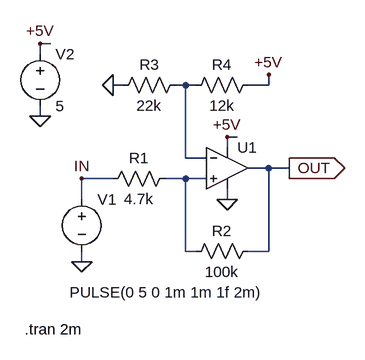
[diagram p0: schematic hys_comparetor.asc]
hys_comparetor.asc, the LTspice schematic file:
Version 4
SHEET 1 880 680
WIRE -64 -16 -80 -16
WIRE -80 0 -80 -16
WIRE 48 48 32 48
WIRE 144 48 128 48
WIRE 160 48 144 48
WIRE 272 48 272 32
WIRE 272 48 240 48
WIRE -80 96 -80 80
WIRE 224 128 208 128
WIRE 208 144 208 128
WIRE 144 160 144 48
WIRE 176 160 144 160
WIRE 272 176 240 176
WIRE 304 176 272 176
WIRE 32 192 -16 192
WIRE 144 192 112 192
WIRE 176 192 144 192
WIRE -16 224 -16 192
WIRE 208 224 208 208
WIRE 144 304 144 192
WIRE 160 304 144 304
WIRE 272 304 272 176
WIRE 272 304 240 304
WIRE -16 320 -16 304
FLAG 208 128 +5V
FLAG 208 224 0
FLAG 304 176 OUT
IOPIN 304 176 Out
FLAG -16 320 0
FLAG -80 96 0
FLAG -80 -16 +5V
FLAG 32 48 0
FLAG 272 32 +5V
FLAG -16 192 IN
SYMBOL Opamps\\UniversalOpamp2 208 176 R0
SYMATTR InstName U1
SYMBOL res 128 176 R90
WINDOW 0 0 56 VBottom 2
WINDOW 3 32 56 VTop 2
SYMATTR InstName R1
SYMATTR Value 4.7k
SYMBOL res 256 288 R90
WINDOW 0 0 56 VBottom 2
WINDOW 3 32 56 VTop 2
SYMATTR InstName R2
SYMATTR Value 100k
SYMBOL voltage -16 208 R0
WINDOW 3 -19 159 Left 2
WINDOW 123 0 0 Left 0
WINDOW 39 0 0 Left 0
SYMATTR Value PULSE(0 5 0 1m 1m 1f 2m)
SYMATTR InstName V1
SYMBOL voltage -80 -16 R0
WINDOW 123 0 0 Left 0
WINDOW 39 0 0 Left 0
SYMATTR InstName V2
SYMATTR Value 5
SYMBOL res 144 32 R90
WINDOW 0 0 56 VBottom 2
WINDOW 3 32 56 VTop 2
SYMATTR InstName R3
SYMATTR Value 22k
SYMBOL res 256 32 R90
WINDOW 0 0 56 VBottom 2
WINDOW 3 32 56 VTop 2
SYMATTR InstName R4
SYMATTR Value 12k
TEXT -104 424 Left 2 !.tran 2m

The netlist it stands for:
* hys_comparetor.asc
XU1 N002 N001 +5V 0 OUT level.2 Avol=1Meg GBW=10Meg Slew=10Meg ilimit=25m rail=0 Vos=0 phimargin=45 en=0 enk=0 in=0 ink=0 Rin=500Meg  ; pins IN+ IN- V+ V- OUT
R1 N002 IN 4.7k
R2 OUT N002 100k
V1 IN 0 PULSE(0 5 0 1m 1m 1f 2m)
V2 +5V 0 5
R3 N001 0 22k
R4 +5V N001 12k
.tran 2m
.lib UniversalOpamps2.sub
.backanno
.end